# Altium schematic sheet sb-sonata-microsd.SchDoc: MicroSD Card Connector
size Letter; Organization: NewAE Technology Inc.; Address1: 1083 Queen St., Suite 196; Address2: Halifax; Address3: NS; Address4: Canada B3H 0B2; SheetNumber: 9; SheetTotal: 20; SheetApproved: YES
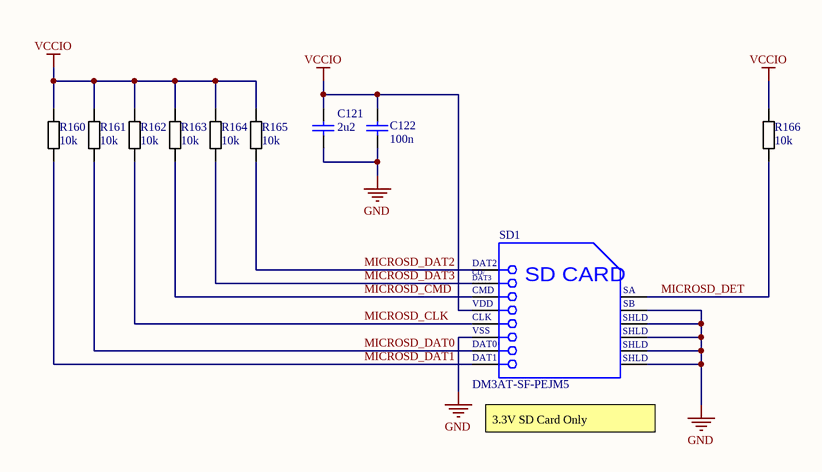
[diagram p0: sb-sonata-microsd.SchDoc]

## Parts
C121  2u2  [CAPC0603_M]
C122  100n  [CAPC0402_M]
R160  10k  [RESC1005X40N]
R161  10k  [RESC1005X40N]
R162  10k  [RESC1005X40N]
R163  10k  [RESC1005X40N]
R164  10k  [RESC1005X40N]
R165  10k  [RESC1005X40N]
R166  10k  [RESC1005X40N]
SD1  DM3AT-SF-PEJM5  [FP-DM3AT-SF-PEJM5-MFG]

## Nets
GND: C121.2 C122.2 SD1.6(VSS) SD1.10(SB) SD1.11(SHLD) SD1.12(SHLD) SD1.13(SHLD) SD1.14(SHLD)
VCCIO: C121.1 C122.1 R160.2 R161.2 R162.2 R163.2 R164.2 R165.2 R166.2 SD1.4(VDD)
MICROSD_CLK: R162.1 SD1.5(CLK)
MICROSD_CMD: R163.1 SD1.3(CMD)
MICROSD_DAT0: R161.1 SD1.7(DAT0)
MICROSD_DAT1: R160.1 SD1.8(DAT1)
MICROSD_DAT2: R165.1 SD1.1(DAT2)
MICROSD_DAT3: R164.1 SD1.2(CD/DAT3)
MICROSD_DET: R166.1 SD1.9(SA)

## Notes on the sheet
- (near SD1) 3.3V SD Card Only
- Title:
- Date:
- Rev:
- Time:
- Project:
- Sheet
- of
- License:
- Copyright © NewAE Technology Inc.
- Approved:
- NewAE.com
- File:
- (in symbol CMP-2000-05150-1) CD/; DAT3; SD CARD

## Library data of the parts
C121 = CCHIP-2u2-0603: 2u2, 0603; Manufacture 1: Samsung; Manufacture Part Number 1: CL10B225KP8NNNC; Component Group: Capacitor; Case-EIA: 0603; Case-Metric: 1608; Rated Voltage: 10VDC; Part Number: CCHIP-2u2-0603; Footprint: 0603; Pin Count: 2; Supplier 1: Digi-Key; Supplier Part Number 1: 1276-1134-2-ND; Value: 2u2; Mounting Technology: SMT; Component Kind: Standard; Component Type: Standard
C122 = CCHIP-100n-0402: 100n, 0402; Manufacture Part Number 1: CGA2B3X7R1V104K050BB; Component Group: Capacitor; Case-EIA: 0402; Part Number: CCHIP-100n-0402; Footprint: 0402; Pin Count: 2; Supplier 1: Digi-Key; Supplier Part Number 1: 445-6901-1-ND; Value: 100n; Mounting Technology: SMT; Component Kind: Standard; Component Type: Standard
R160-R166 = RCHIP-10K-0402: 10k res, 0402, 1%, 1/16W; Manufacture 1: Yageo; Manufacture Part Number 1: RC0402FR-0710KL; Component Group: Resistor; Case-EIA: 0402; Case-Metric: 1005; Rated Power: 0.063W; Rated Voltage: 75VDC; Part Number: RCHIP-10K-0402; Footprint: 0402; Pin Count: 2; Supplier 1: Digi-Key; Supplier Part Number 1: 311-10.0KLRCT-ND; Value: 10k; Tolerance: 1%; Mounting Technology: SMT; Temperature Range: -55C to 155C; Component Kind: Standard; Component Type: Standard
SD1 = CMP-2000-05150-1: Micro SD Card Connector, 0.5 A, 125 V, -25 to 85 degC, 8-Pin SMD, RoHS, Tape and Reel; Manufacturer: Hirose Electric; Featured Product: DM3ATSeries; HTML Datasheet: DM3SeriesmicroSD.html; Other Names: HR1964DKR; Connector Type: ConnectorandEjector; Insertion, Removal Method: PushIn,PushOut; Card Type: SecureDigital-microSD™; Online Catalog: DM3Series; Number of Positions: 10(8+2); Product Training Modules: DM3SeriesmicroSDCardSockets; Manufacturer URL: https://www.hirose.com; Contact Finish: Gold; Height Above Board: 0.066"(1.68mm); Family: MemoryConnectors-PCCardSockets; Package Reference: DM3AT-8; Category: Connectors,Interconnects; Features: Switch; Mounting Type: SurfaceMount,RightAngle; Datasheet Version: Jun-10; Package Description: 8-Pin Surface Mount Device, Body 16.15 x 13.85 mm, Pitch 1.1 mm; Standard Package: 1; Contact Finish Thickness: -; Datasheet URL: https://ciiva.com/datasheet-click-46418261?src=ciiva&sig=4019062a; Mounting Feature: Normal,Standard-Top; Series: DM3; Packaging: Digi-Reel; Package URL: https://www.hirose.com/product/en/download_file/key_name/DM3/category/Catalog/doc_file_id/49662/?file_category_id=4&item_id=195&is_series=1; Ejector Side: -